# Altium schematic sheet GridEye_STM32.SchDoc
size A2
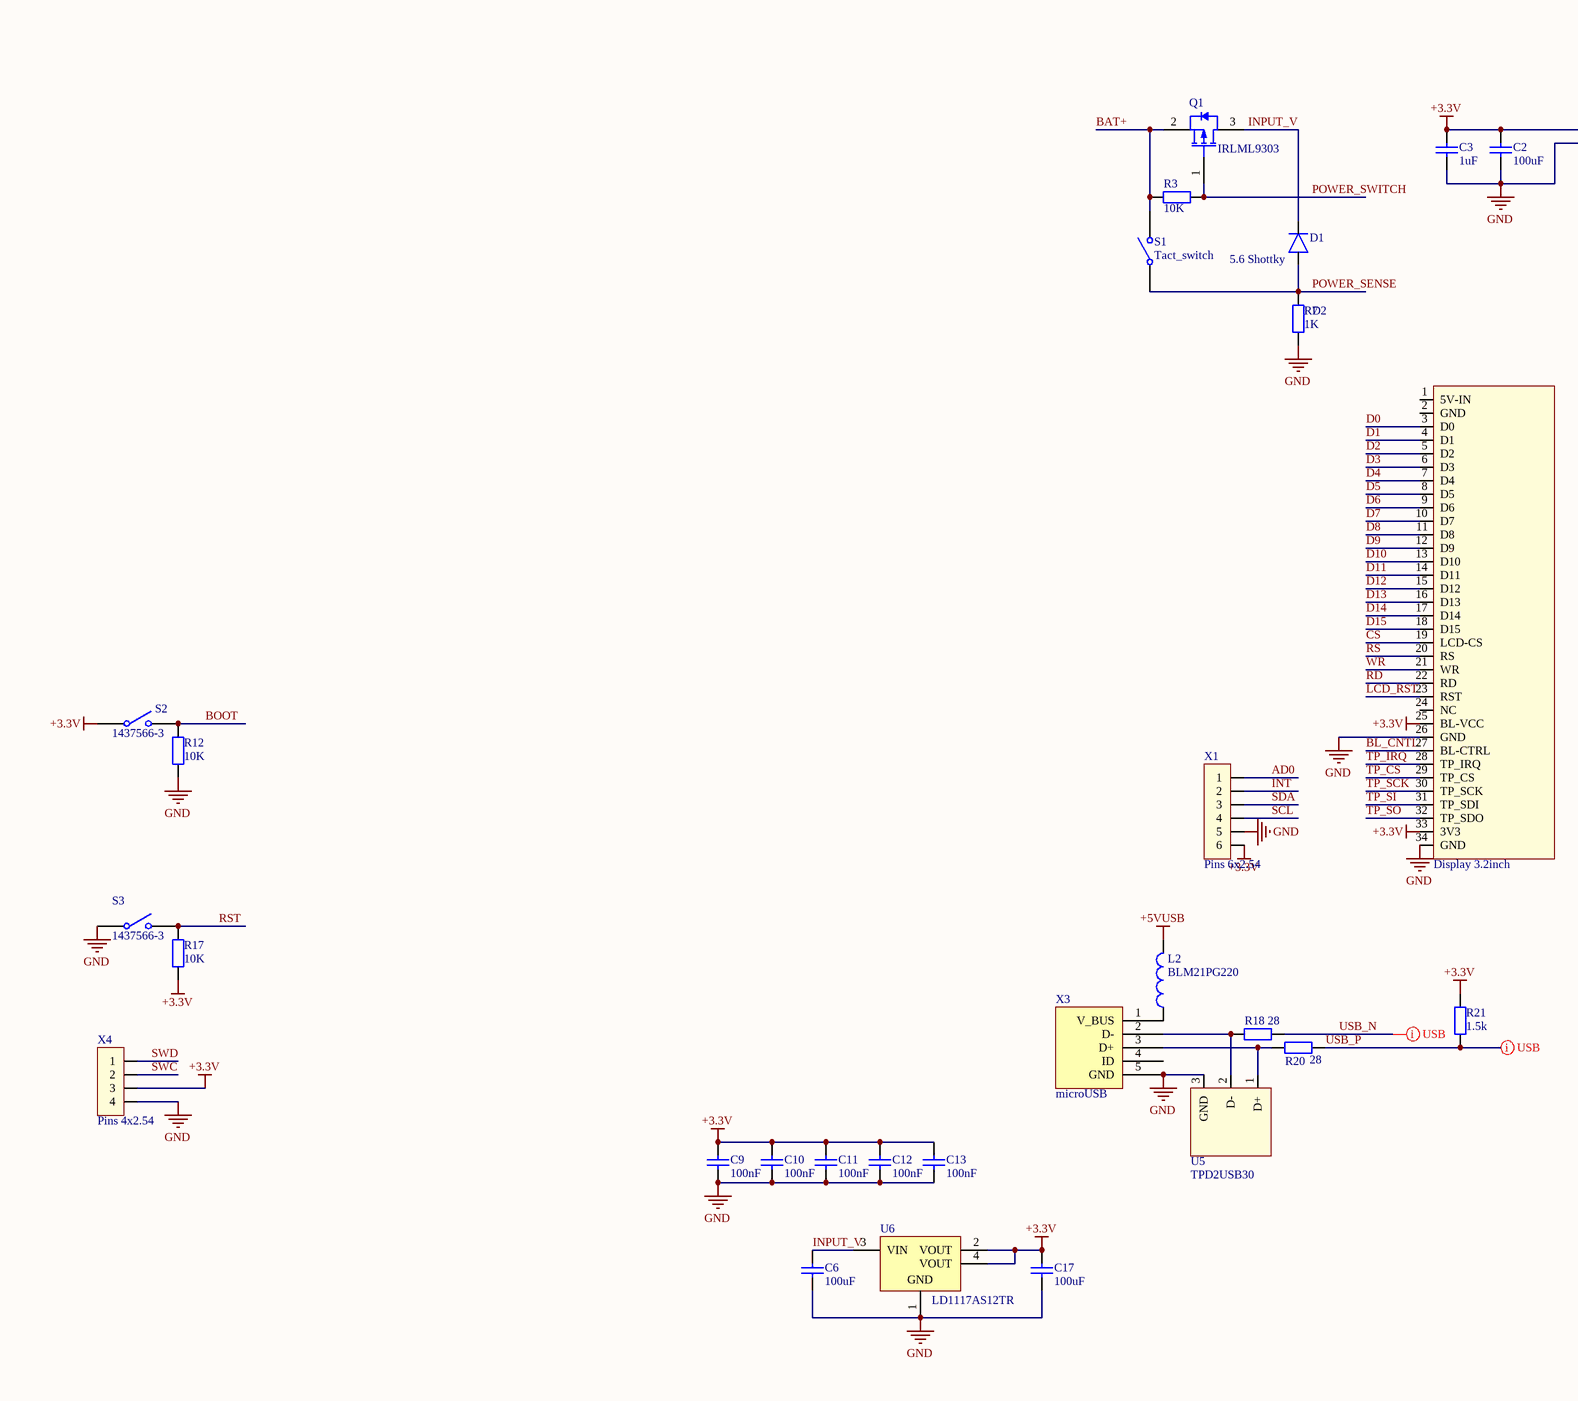
[diagram p0: GridEye_STM32.SchDoc, left]
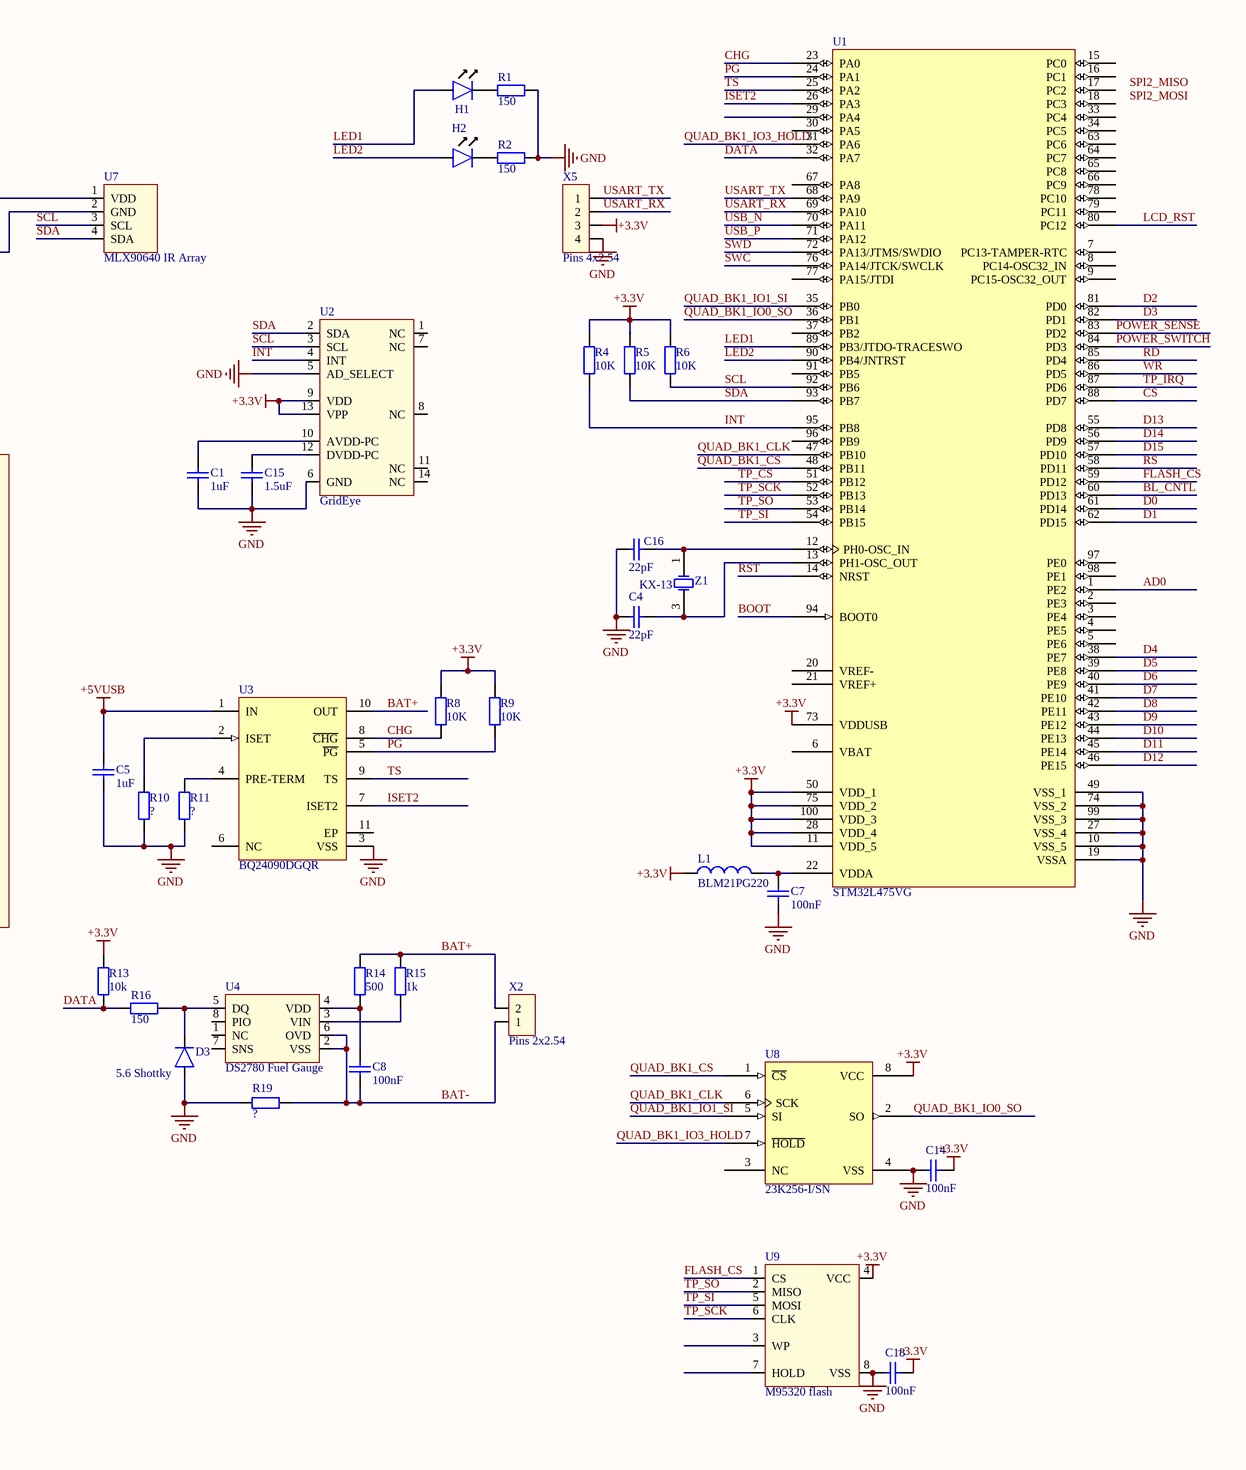
[diagram p1: GridEye_STM32.SchDoc, right]

## Parts
C1  1uF  [C0603]
C2  100uF  [C0603]
C3  1uF  [C0603]
C4  22pF  [C0603]
C5  1uF  [C0603]
C6  100uF  [C0603]
C7  100nF  [C0603]
C8  100nF  [C0603]
C9  100nF  [C0603]
C10  100nF  [C0603]
C11  100nF  [C0603]
C12  100nF  [C0603]
C13  100nF  [C0603]
C14  100nF  [C0603]
C15  1.5uF  [C0603]
C16  22pF  [C0603]
C17  100uF  [C0603]
C18  100nF  [C0603]
D1  5.6 Shottky  [SMA_Diode]
D2  Display 3.2inch  [Display_3.2inch]
D3  5.6 Shottky  [SMA_Diode]
H1  LED_SMD  [C0603]  (value not drawn)
H2  LED_SMD  [C0603]  (value not drawn)
L1  BLM21PG220  [L0603]
L2  BLM21PG220  [L0603]
Q1  IRLML9303  [INF-PG-SOT23_N]
R1  150  [R0603]
R2  150  [R0603]
R3  10K  [R0603]
R4  10K  [R0603]
R5  10K  [R0603]
R6  10K  [R0603]
R7  1K  [R0603]
R8  10K  [R0603]
R9  10K  [R0603]
R10  ?  [R0603]
R11  ?  [R0603]
R12  10K  [R0603]
R13  10k  [R0603]
R14  500  [R0603]
R15  1k  [R0603]
R16  150  [R0603]
R17  10K  [R0603]
R18  28  [R0603]
R19  ?  [R0603]
R20  28  [R0603]
R21  1.5k  [R0603]
S1  Tact_switch  [Tact_switch_DIP_angle_]
S2  1437566-3  [Tact_switch_smd]
S3  1437566-3  [Tact_switch_smd]
U1  STM32L475VG  [LQFP100_N]
U2  GridEye  [Panasonic GridEye]
U3  BQ24090DGQR  [DGQ10-1675X1445TP_N]
U4  DS2780 Fuel Gauge  [TSSOP-8]
U5  TPD2USB30  [SOT_TPD2USB30]
U6  LD1117AS12TR  [SOT-223_N]
U7  MLX90640 IR Array  [MLX90640]
U8  23K256-I/SN  [SOIC-SN8_N]
U9  M95320 flash  [TSSOP-8]
X1  Pins 6x2.54  [Pins 6x2.54]
X2  Pins 2x2.54  [Pins 2x2.54]
X3  microUSB  [microUSB]
X4  Pins 4x2.54  [Pins 4x2.54]
X5  Pins 4x2.54  [Pins 4x2.54]
Z1  KX-13  [kx 13 12MHz]

## Nets
+3.3V: C2.1 C3.1 C9.2 C10.2 C11.2 C12.2 C13.2 C14.1 C17.2 C18.1 D2.25(BL-VCC) D2.33(3V3) L1.1 R4.2 R5.2 R6.2 R8.1 R9.1 R13.1 R17.1 R21.2 S2.1(COMMON) U1.11(VDD_5) U1.28(VDD_4) U1.50(VDD_1) U1.73(VDDUSB) U1.75(VDD_2) U1.100(VDD_3) U2.9(VDD) U2.13(VPP) U6.2(VOUT) U6.4(VOUT) U7.1(VDD) U8.8(VCC) U9.4(VCC) X1.6 X4.3 X5.3
+5VUSB: C5.2 L2.2 U3.1(IN)
GND: C1.2 C2.2 C3.2 C4.2 C5.1 C6.1 C7.1 C9.1 C10.1 C11.1 C12.1 C13.1 C14.2 C15.2 C16.2 C17.1 C18.2 D2.26(GND) D2.34(GND) D3.1 R1.1 R2.1 R7.2 R10.2 R11.2 R12.1 R19.1 S3.1(COMMON) U1.10(VSS_5) U1.19(VSSA) U1.27(VSS_4) U1.49(VSS_1) U1.74(VSS_2) U1.99(VSS_3) U2.5(AD_SELECT) U2.6(GND) U3.3(VSS) U5.3(GND) U6.1(GND) U7.2(GND) U8.4(VSS) U9.8(VSS) X1.5 X3.5(GND) X4.4 X5.4
AD0: U1.1(PE2) X1.1
BAT+: Q1.2(SOURCE) R3.1 R14.1 R15.1 S1.2(NO) U3.10(OUT) X2.2
BAT-: C8.1 R19.2 U4.2(VSS) U4.6(OVD) X2.1
BL_CNTL: D2.27(BL-CTRL) U1.60(PD13)
BOOT: R12.2 S2.2(NO) U1.94(BOOT0)
CHG: R8.2 U1.23(PA0) U3.8(~{CHG})
CS: D2.19(LCD-CS) U1.88(PD7)
D0: D2.3(D0) U1.61(PD14)
D1: D2.4(D1) U1.62(PD15)
D2: D2.5(D2) U1.81(PD0)
D3: D2.6(D3) U1.82(PD1)
D4: D2.7(D4) U1.38(PE7)
D5: D2.8(D5) U1.39(PE8)
D6: D2.9(D6) U1.40(PE9)
D7: D2.10(D7) U1.41(PE10)
D8: D2.11(D8) U1.42(PE11)
D9: D2.12(D9) U1.43(PE12)
D10: D2.13(D10) U1.44(PE13)
D11: D2.14(D11) U1.45(PE14)
D12: D2.15(D12) U1.46(PE15)
D13: D2.16(D13) U1.55(PD8)
D14: D2.17(D14) U1.56(PD9)
D15: D2.18(D15) U1.57(PD10)
DATA: R13.2 R16.2 U1.32(PA7)
FLASH_CS: U1.59(PD12) U9.1(CS)
INPUT_V: C6.2 D1.2 Q1.3(DRAIN) U6.3(VIN)
INT: R4.1 U1.95(PB8) U2.4(INT) X1.2
ISET2: U1.26(PA3) U3.7(ISET2)
LCD_RST: D2.23(RST) U1.80(PC12)
LED1: H1.1 U1.89(PB3/JTDO-TRACESWO)
LED2: H2.1 U1.90(PB4/JNTRST)
PG: R9.2 U1.24(PA1) U3.5(~{PG})
POWER_SENSE: D1.1 R7.1 S1.1(COMMON) U1.83(PD2)
POWER_SWITCH: Q1.1(GATE) R3.2 U1.84(PD3)
QUAD_BK1_CLK: U1.47(PB10) U8.6(SCK)
QUAD_BK1_CS: U1.48(PB11) U8.1(~{CS})
QUAD_BK1_IO0_SO: U1.36(PB1) U8.2(SO)
QUAD_BK1_IO1_SI: U1.35(PB0) U8.5(SI)
QUAD_BK1_IO3_HOLD: U1.31(PA6) U8.7(~{HOLD})
RD: D2.22(RD) U1.85(PD4)
RS: D2.20(RS) U1.58(PD11)
RST: R17.2 S3.2(NO) U1.14(NRST)
SCL: R6.1 U1.92(PB6) U2.3(SCL) U7.3(SCL) X1.4
SDA: R5.1 U1.93(PB7) U2.2(SDA) U7.4(SDA) X1.3
SWC: U1.76(PA14/JTCK/SWCLK) X4.2
SWD: U1.72(PA13/JTMS/SWDIO) X4.1
TP_CS: D2.29(TP_CS) U1.51(PB12)
TP_IRQ: D2.28(TP_IRQ) U1.87(PD6)
TP_SCK: D2.30(TP_SCK) U1.52(PB13) U9.6(CLK)
TP_SI: D2.31(TP_SDI) U1.54(PB15) U9.5(MOSI)
TP_SO: D2.32(TP_SDO) U1.53(PB14) U9.2(MISO)
TS: U1.25(PA2) U3.9(TS)
USART_RX: U1.69(PA10) X5.2
USART_TX: U1.68(PA9) X5.1
USB_N: R18.2 U1.70(PA11)
USB_P: R20.2 R21.1 U1.71(PA12)
WR: D2.21(WR) U1.86(PD5)
NetC1_1: C1.1 U2.10(AVDD-PC)
NetC4_1: C4.1 U1.13(PH1-OSC_OUT) Z1.3(OSC2)
NetC7_2: C7.2 L1.2 U1.22(VDDA)
NetC8_2: C8.2 R14.2 U4.4(VDD)
NetC15_1: C15.1 U2.12(DVDD-PC)
NetC16_1: C16.1 U1.12(PH0-OSC_IN) Z1.1(OSC1)
NetD3_2: D3.2 R16.1 U4.5(DQ)
NetH1_2: H1.2 R1.2
NetH2_2: H2.2 R2.2
NetL2_1: L2.1 X3.1(V_BUS)
NetR10_1: R10.1 U3.2(ISET)
NetR11_1: R11.1 U3.4(PRE-TERM)
NetR15_2: R15.2 U4.3(VIN)
NetR18_1: R18.1 U5.2(D-) X3.2(D-)
NetR20_1: R20.1 U5.1(D+) X3.3(D+)

Not connected (* = marked no-connect by the designer): D2 1(5V-IN) 2(GND) 24(NC); U1 2(PE3) 3(PE4) 4(PE5) 5(PE6) 6(VBAT) 7(PC13-TAMPER-RTC) 8(PC14-OSC32_IN) 9(PC15-OSC32_OUT) 15(PC0) 16(PC1) 17(PC2) 18(PC3) 20(VREF-) 21(VREF+) 29(PA4) 30(PA5) 33(PC4) 34(PC5) 37(PB2) 63(PC6) 64(PC7) 65(PC8) 66(PC9) 67(PA8) 77(PA15/JTDI) 78(PC10) 79(PC11) 91(PB5) 96(PB9) 97(PE0) 98(PE1); U2 1(NC) 7(NC) 8(NC) 11(NC) 14(NC); U3 6(NC) 11(EP); U4 1(NC) 7(SNS) 8(PIO); U8 3(NC); U9 3(WP) 7(HOLD); X3 4(ID)

## Layout directives
differential pair: USB_N, USB_P

## Notes on the sheet
- Labels drawn without touching a wire or pin: SPI2_MISO, SPI2_MOSI

## Library data of the parts
C1-C18 = Condensator
D1 D3 = Diod
D2 = Display_3.2inch
L1 L2 = Inductance
Q1 = BSS215P H6327: P-Channel OptiMOS P2 Small-Signal-Transistor, -20 V VDS, -1.5 A ID, -55 to 150 degC, PG-SOT23, Reel, Green; Manufacturer: Infineon; Green: TRUE; ID (max): -1.5 A; IDpuls (max): -6 A; Pto t (max): 0.5 W; QG: -3.6 nC; RDS (on) (max): 280 mOhm; RDS (on) (max) (@4.5V): 150 mOhm; Rth: 250 K/W; VDS (max): -20 V; VGS(th) (max): -0.6 V; VGS(th) (min): -1.2 V; DatasheetVersion: Rev. 2.3; PackageVersion: Apr-08; PackageReference: PG-SOT23; PackageDescription: 3-Pin Small Outline Transistor Package, 2.9 x 1.3 mm Body, 0.95 mm Pitch; Supplier 1: Digi-Key; Supplier Part Number 1: BSS215P H6327TR-ND; Supplier 2: Digi-Key; Supplier Part Number 2: BSS215P H6327CT-ND; Supplier 3: Digi-Key; Supplier Part Number 3: BSS215P H6327DKR-ND; Halogen-free: TRUE; Packing: Reel; RDS (on) (max) (@2.5V): 280 mOhm; Mounting Technology: Surface Mount; PartNumber: BSS215P H6327; ComponentLink1Description: Manufacturer URL; ComponentLink1URL: http://www.infineon.com/; ComponentLink2Description: Datasheet; ComponentLink2URL: http://www.infineon.com/dgdl/BSS215P_Rev2.3.pdf?folderId=db3a304314dca38901154a72e3951a65&fileId=db3a304330f6860601311833f57144fb; ComponentLink3Description: Package Specification; ComponentLink3URL: http://www.infineon.com/dgdl/SOT23-Package_Overview.pdf?folderId=db3a30431936bc4b0119532290053c66&fileId=db3a30431936bc4b0119533468123c85
R1-R21 = Resistor
S2 S3 = Tact_switch
U1 = STM32L475VG: STM32 ARM-based 32-bit MCU with 1 Mbyte Flash, 100-pin LQFP; Published: 01-JUILLET-2018; DatasheetVersion: Juillet 2018Mar-2008; PackageVersion: JUI-2018; PackageReference: LQFP100; Publisher: Altium Limited; PackageDescription: 100-Pin Low-Profile Quad Flat Pack, 14 x 14 mm Body, 0.5 mm Pitch (LQFP100); ComponentLink1Description: Manufacturer Link; ComponentLink1URL: www.st.com/stm32; ComponentLink2Description: Datasheet; ComponentLink2URL: https://www.st.com/resource/en/datasheet/stm32l475vg.pdf
U2 = Panasonic GridEye
U3 = BQ24090DGQR: 1 A, Single Input, Single Cell Li-Ion Battery Charger with 10 K ohm NTC, 4.5 V, -40 to 150 degC, 10-pin MSOP-PowerPAD (DGQ), Green (RoHS & no Sb/Br); Manufacturer: Texas Instruments; Lead Acid: N; SubFamily: Battery Charge Management; Vin(Min)(V): 4.5; DatasheetVersion: SLUS968C; PackageVersion: revF, Nov-2011; PackageReference: DGQ10-1675X1445TP; PackageDescription: 10-Pin PowerPAD Plastic Small Outline 0.5 mm Pitch, Exposed Pad; Supplier 1: Digi-Key; Supplier Part Number 1: BQ24090DGQR-ND; Supplier 2: Newark; Supplier Part Number 2: 68R5440; Supplier 3: Mouser; Supplier Part Number 3: 595-BQ24090DGQR; Eco-Plan: Green (RoHS & no Sb/Br); Li-Ion: N; Li-Polymer: N; NiCd: N; NiMH: N; Over Voltage Protection: N; Mounting Technology: Surface Mount; PartNumber: BQ24090DGQR; Code_JEDEC: MO-187-BA-T; ComponentLink1Description: Datasheet; ComponentLink1URL: http://www.ti.com/general/docs/lit/getliterature.tsp?genericPartNumber=BQ24090&fileType=pdf
U4 = DS2780+
U5 = TPD2USB30: Usb protector
U6 = LD1117AS12TR: 1A, Low Drop Positive Voltage Regulator, 1.2V, 4-Pin SOT-223, Tape and Reel; DatasheetVersion: Dec-2011; PackageVersion: 2010; PackageReference: SOT-223; PackageDescription: 4-Pin SOT-223 Package, 6.5 x 3.5 mm Body, 2.3 mm Pitch, 7 mm Lead Span; PartNumber: LD1117AS12TR; ComponentLink1Description: Manufacturer URL; ComponentLink1URL: http://www.st.com; ComponentLink2Description: Datasheet; ComponentLink2URL: http://www.st.com/internet/com/TECHNICAL_RESOURCES/TECHNICAL_LITERATURE/DATASHEET/CD00002116.pdf
U7 = MLX90640
U8 = 23K256-I/SN: 256K, 32768x8-bit, 3.6V SPI Serial SRAM, 8-Pin SOIC 3.9mm, Industrial Temperature; Published: 2-Dec-2009; DatasheetVersion: revD, Apr-2009; PackageVersion: revBB, Aug-2009; PackageReference: SOIC-SN8; Publisher: Altium Limited; PackageDescription: 8-Lead Plastic Small Outline (SN) - Narrow, 3.90mm Body [SOIC]; Supplier 1: Digi-Key; Supplier Part Number 1: 23K256-I/SN-ND; Supplier 2: Farnell; Supplier Part Number 2: 1695547; Code_JEDEC: MS-012; Code_IPC: SOIC127P600-8; ComponentLink1Description: Datasheet; ComponentLink1URL: http://ww1.microchip.com/downloads/en/DeviceDoc/22100D.pdf; ComponentLink2Description: Packaging Specification; ComponentLink2URL: http://www.microchip.com/stellent/groups/techpub_sg/documents/packagingspec/en012702.pdf; ComponentLink3Description: Microchip.com Home; ComponentLink3URL: http://www.microchip.com/
U9 = M95320
Z1 = KX 13 Geyer